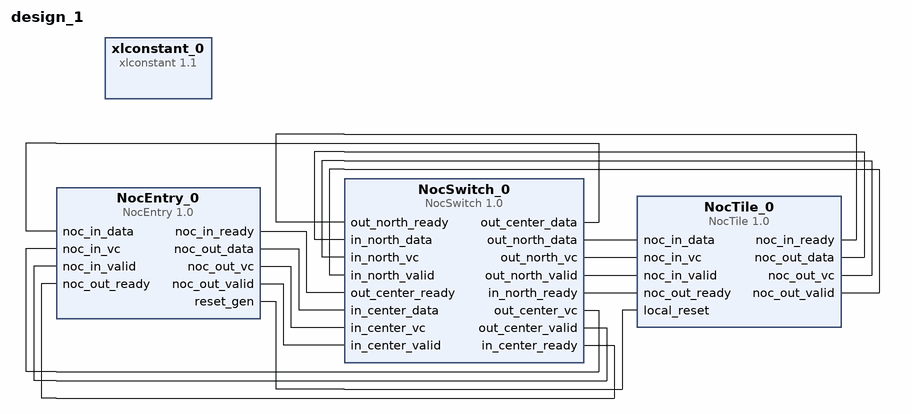
[diagram p0: block diagram of the top level]
# Vivado block design design_1, xc7vx690tffg1761-2, Vivado 2016.4
create_bd_design design_1

create_bd_cell -type ip -vlnv Fabmatics.com:user:NocSwitch:1.0 NocSwitch_0
create_bd_cell -type ip -vlnv Fabmatics.com:user:NocEntry:1.0 NocEntry_0
create_bd_cell -type ip -vlnv Fabmatics.com:user:NocTile:1.0 NocTile_0
create_bd_cell -type ip -vlnv xilinx.com:ip:xlconstant:1.1 xlconstant_0

# ---- connections ----

connect_bd_net [get_bd_pins NocTile_0/noc_in_ready] [get_bd_pins NocSwitch_0/out_north_ready]
connect_bd_net [get_bd_pins NocTile_0/noc_out_data] [get_bd_pins NocSwitch_0/in_north_data]
connect_bd_net [get_bd_pins NocTile_0/noc_out_vc] [get_bd_pins NocSwitch_0/in_north_vc]
connect_bd_net [get_bd_pins NocTile_0/noc_out_valid] [get_bd_pins NocSwitch_0/in_north_valid]
connect_bd_net [get_bd_pins NocSwitch_0/out_north_data] [get_bd_pins NocTile_0/noc_in_data]
connect_bd_net [get_bd_pins NocSwitch_0/out_north_vc] [get_bd_pins NocTile_0/noc_in_vc]
connect_bd_net [get_bd_pins NocSwitch_0/out_north_valid] [get_bd_pins NocTile_0/noc_in_valid]
connect_bd_net [get_bd_pins NocSwitch_0/in_north_ready] [get_bd_pins NocTile_0/noc_out_ready]
connect_bd_net [get_bd_pins NocEntry_0/noc_in_ready] [get_bd_pins NocSwitch_0/out_center_ready]
connect_bd_net [get_bd_pins NocEntry_0/noc_out_data] [get_bd_pins NocSwitch_0/in_center_data]
connect_bd_net [get_bd_pins NocEntry_0/noc_out_vc] [get_bd_pins NocSwitch_0/in_center_vc]
connect_bd_net [get_bd_pins NocEntry_0/noc_out_valid] [get_bd_pins NocSwitch_0/in_center_valid]
connect_bd_net [get_bd_pins NocSwitch_0/out_center_data] [get_bd_pins NocEntry_0/noc_in_data]
connect_bd_net [get_bd_pins NocSwitch_0/out_center_vc] [get_bd_pins NocEntry_0/noc_in_vc]
connect_bd_net [get_bd_pins NocSwitch_0/out_center_valid] [get_bd_pins NocEntry_0/noc_in_valid]
connect_bd_net [get_bd_pins NocSwitch_0/in_center_ready] [get_bd_pins NocEntry_0/noc_out_ready]
connect_bd_net [get_bd_pins NocEntry_0/reset_gen] [get_bd_pins NocTile_0/local_reset]

validate_bd_design
save_bd_design
